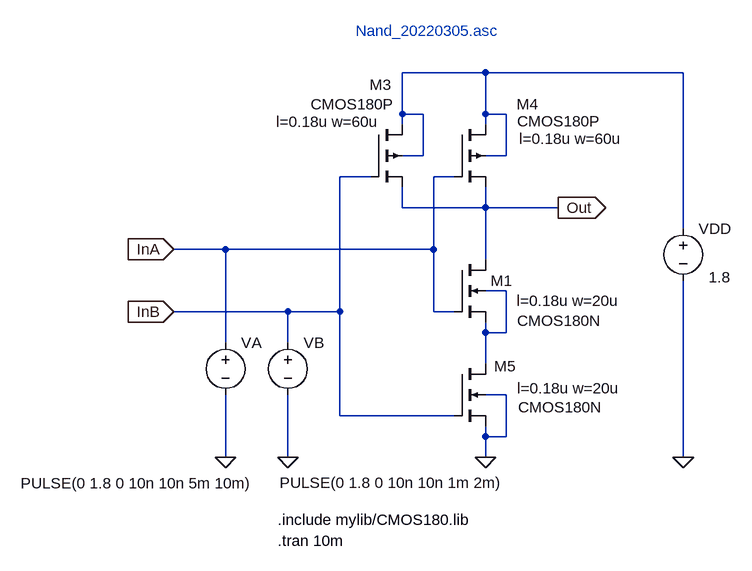
[diagram p0: schematic Nand_20220305.asc]
Nand_20220305.asc, the LTspice schematic file:
Version 4
SHEET 1 1036 680
WIRE 224 -272 96 -272
WIRE 528 -272 224 -272
WIRE 96 -208 96 -272
WIRE 128 -208 96 -208
WIRE 224 -208 224 -272
WIRE 256 -208 224 -208
WIRE 96 -192 96 -208
WIRE 224 -192 224 -208
WIRE 128 -144 128 -208
WIRE 128 -144 96 -144
WIRE 256 -144 256 -208
WIRE 256 -144 224 -144
WIRE 48 -112 0 -112
WIRE 176 -112 144 -112
WIRE 96 -64 96 -96
WIRE 224 -64 224 -96
WIRE 224 -64 96 -64
WIRE 336 -64 224 -64
WIRE 528 -32 528 -272
WIRE -176 0 -256 0
WIRE 144 0 144 -112
WIRE 144 0 -176 0
WIRE 224 16 224 -64
WIRE 256 64 224 64
WIRE -80 96 -256 96
WIRE 0 96 0 -112
WIRE 0 96 -80 96
WIRE 144 96 144 0
WIRE 176 96 144 96
WIRE 224 128 224 112
WIRE 256 128 256 64
WIRE 256 128 224 128
WIRE -176 144 -176 0
WIRE -80 144 -80 96
WIRE 224 176 224 128
WIRE 256 224 224 224
WIRE 0 256 0 96
WIRE 176 256 0 256
WIRE 224 288 224 272
WIRE 256 288 256 224
WIRE 256 288 224 288
WIRE -176 320 -176 224
WIRE -80 320 -80 224
WIRE 224 320 224 288
WIRE 528 320 528 48
FLAG 224 320 0
FLAG 336 -64 Out
IOPIN 336 -64 Out
FLAG -256 0 InA
IOPIN -256 0 In
FLAG -256 96 InB
IOPIN -256 96 In
FLAG 528 320 0
FLAG -176 320 0
FLAG -80 320 0
SYMBOL nmos4 176 16 R0
WINDOW 123 96 63 Left 2
WINDOW 3 97 94 Left 2
SYMATTR Value2 l=0.18u w=20u
SYMATTR InstName M1
SYMATTR Value CMOS180N
SYMBOL voltage 528 -48 R0
WINDOW 3 39 91 Left 2
WINDOW 123 0 0 Left 0
WINDOW 39 0 0 Left 0
SYMATTR Value 1.8
SYMATTR InstName VDD
SYMBOL voltage -176 128 R0
WINDOW 3 -315 232 Left 2
WINDOW 123 0 0 Left 0
WINDOW 39 0 0 Left 0
SYMATTR Value PULSE(0 1.8 0 10n 10n 5m 10m)
SYMATTR InstName VA
SYMBOL pmos4 48 -192 R0
WINDOW 0 -2 -61 Left 2
WINDOW 3 -93 -31 Left 2
WINDOW 123 -146 -4 Left 2
SYMATTR InstName M3
SYMATTR Value CMOS180P
SYMATTR Value2 l=0.18u w=60u
SYMBOL pmos4 176 -192 R0
WINDOW 0 96 -31 Left 2
WINDOW 3 97 -5 Left 2
WINDOW 123 100 22 Left 2
SYMATTR InstName M4
SYMATTR Value CMOS180P
SYMATTR Value2 l=0.18u w=60u
SYMBOL nmos4 176 176 R0
WINDOW 123 97 38 Left 2
WINDOW 0 61 4 Left 2
WINDOW 3 98 67 Left 2
SYMATTR Value2 l=0.18u w=20u
SYMATTR InstName M5
SYMATTR Value CMOS180N
SYMBOL voltage -80 128 R0
WINDOW 3 -13 231 Left 2
WINDOW 123 0 0 Left 0
WINDOW 39 0 0 Left 0
SYMATTR Value PULSE(0 1.8 0 10n 10n 1m 2m)
SYMATTR InstName VB
TEXT -96 416 Left 2 !.include mylib/CMOS180.lib
TEXT 24 -336 Left 2 ;Nand_20220305.asc
TEXT -96 448 Left 2 !.tran 10m

The netlist it stands for:
* Nand_20220305.asc
M1 Out InA N002 N002 CMOS180N l=0.18u w=20u
VDD N001 0 1.8
VA InA 0 PULSE(0 1.8 0 10n 10n 5m 10m)
M3 N001 InB Out N001 CMOS180P l=0.18u w=60u
M4 N001 InA Out N001 CMOS180P l=0.18u w=60u
M5 N002 InB 0 0 CMOS180N l=0.18u w=20u
VB InB 0 PULSE(0 1.8 0 10n 10n 1m 2m)
.model NMOS NMOS
.model PMOS PMOS
.lib standard.mos
.include mylib/CMOS180.lib
* Nand_20220305.asc
.tran 10m
.backanno
.end